# Altium project HMI_Driver.PrjPCB
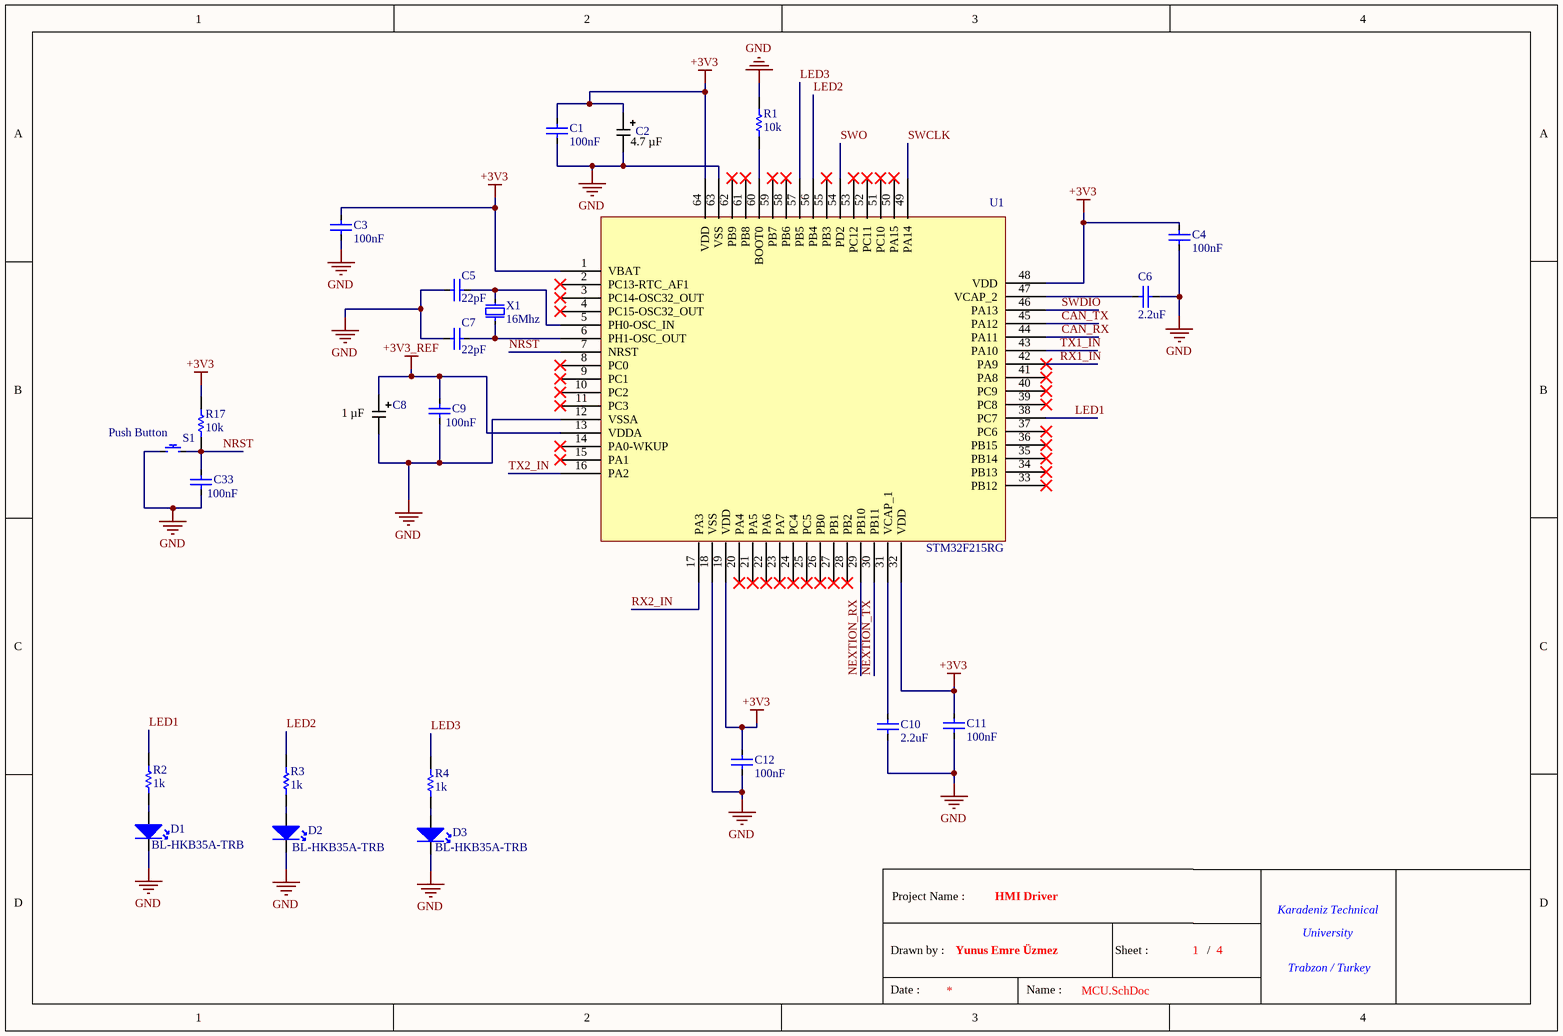
[diagram p0: MCU.SchDoc]
Person: Yunus Emre Üzmez; Project: HMI Driver
4 sheets, 82 parts. Net scope: global (net labels, ports and power ports of the same name join across sheets).
Board file: hmi_driver.PcbDoc
Sheets:
  MCU.SchDoc
  Peripheral.SchDoc
  Power.SchDoc
  Connectors.SchDoc

## Sheet MCU.SchDoc
size A4; DocumentNumber: 1; SheetNumber: 1; SheetTotal: 4

### Parts
(Parts that share a designator on the sheet are numbered #1, #2 ... from top to bottom, then left to right.)
*#1  Title Block  (value not drawn)  (graphical)
C1  100nF  [CAP-0603]
C2  Capacitance: 4.7 µF  [KEMET_CAP_TAN-B]  (hidden comment: T491B475K016AT)
C3  100nF  [CAP-0603]
C4  100nF  [CAP-0603]
C5  22pF  [CAP-0805]
C6  2.2uF  [CAP-0805]
C7  22pF  [CAP-0805]
C8  Capacitance: 1 µF  [KEMET_CAP_TAN-B]  (hidden comment: T491B105K025AT)
C9  100nF  [CAP-0603]
C10  2.2uF  [CAP-0805]
C11  100nF  [CAP-0603]
C12  100nF  [CAP-0603]
C33  100nF  [CAP-0603]
D1  BL-HKB35A-TRB  [LED-0805]
D2  BL-HKB35A-TRB  [LED-0805]
D3  BL-HKB35A-TRB  [LED-0805]
R1  10k  [RES-0603]
R2  1k  [RES-0603]
R3  1k  [RES-0603]
R4  1k  [RES-0603]
R17  10k  [RES-0603]
S1  Push Button  [2.54mm_Push Button]  (no BOM)
U1  STM32F215RG  [LQFP64]
X1  16Mhz  [OSC-THT (11.5*5.00*3.60)]

### Nets
+3V3: C1.2 C2.1 C3.2 C4.2 C11.2 C12.2 R17.1 U1.1(VBAT) U1.19(VDD) U1.32(VDD) U1.48(VDD) U1.64(VDD)
+3V3_REF: C8.1 C9.2 U1.13(VDDA)
GND: C1.1 C2.2 C3.1 C4.1 C5.2 C6.1 C7.1 C8.2 C9.1 C10.1 C11.1 C12.1 C33.1 D1.2(K) D2.2(K) D3.2(K) R1.2 S1.1 U1.12(VSSA) U1.18(VSS) U1.63(VSS)
CAN_RX: U1.44(PA11)
CAN_TX: U1.45(PA12)
LED1: R2.1 U1.38(PC7)
LED2: R3.1 U1.56(PB4)
LED3: R4.1 U1.57(PB5)
NEXTION_RX: U1.29(PB10)
NEXTION_TX: U1.30(PB11)
NRST: C33.2 R17.2 S1.2 U1.7(NRST)
RX1_IN: U1.42(PA9)
RX2_IN: U1.17(PA3)
SWCLK: U1.49(PA14)
SWDIO: U1.46(PA13)
SWO: U1.54(PD2)
TX1_IN: U1.43(PA10)
TX2_IN: U1.16(PA2)
NetC5_1: C5.1 U1.5(PH0-OSC_IN) X1.2
NetC6_2: C6.2 U1.47(VCAP_2)
NetC7_2: C7.2 U1.6(PH1-OSC_OUT) X1.1
NetC10_2: C10.2 U1.31(VCAP_1)
NetD1_1: D1.1(A) R2.2
NetD2_1: D2.1(A) R3.2
NetD3_1: D3.1(A) R4.2
NetR1_1: R1.1 U1.60(BOOT0)

Not connected (* = marked no-connect by the designer): U1 2(PC13-RTC_AF1)* 3(PC14-OSC32_OUT)* 4(PC15-OSC32_OUT)* 8(PC0)* 9(PC1)* 10(PC2)* 11(PC3)* 14(PA0-WKUP)* 15(PA1)* 20(PA4)* 21(PA5)* 22(PA6)* 23(PA7)* 24(PC4)* 25(PC5)* 26(PB0)* 27(PB1)* 28(PB2)* 33(PB12)* 34(PB13)* 35(PB14)* 36(PB15)* 37(PC6)* 39(PC8)* 40(PC9)* 41(PA8)* 50(PA15)* 51(PC10)* 52(PC11)* 53(PC12)* 55(PB3)* 58(PB6)* 59(PB7)* 61(PB8)* 62(PB9)*

### Notes on the sheet
- (in symbol Title Block) Project Name :; Karadeniz Technical; University; Drawn by :; Sheet :; /; Trabzon / Turkey; Date :; Name :

### Library data of the parts
*#1 = Title Block: Standart Title Block
C1 C3 C4 C9 C11 C12 C33 = CGA3E2X7R1H104K080AA: Manufacturer: TDK; Temperature Coefficient: X7R; Voltage: 50V; Library Reference: Capacitor; Tolerance: %10; Man Code: CGA3E2X7R1H104K080AA; Value: 100nF; Footprint: 0603; Component Type: Ceramic Capacitor
C2 = T491B475K016AT: CAP TANT 4.7UF 10% 16V 1411; Manufacturer: KEMET; Manufacturer Size Code: B; Type: Molded; ESR (Equivalent Series Resistance): 3.5 Ohm; Lifetime @ Temp.: 2000 Hrs @ 125°C; Series: T491; Package: Tape & Reel (TR); Tolerance: ±10%; Operating Temperature: -55°C ~ 125°C; Mounting Type: Surface Mount; Package / Case: 1411 (3528 Metric); Size / Dimension: 0.138" L x 0.110" W (3.50mm x 2.80mm); Height - Seated (Max): 0.083" (2.10mm); Lead Spacing: -; Ratings: -; Features: General Purpose; Failure Rate: -; Voltage - Rated: 16 V; Ozdisan Link: https://ozdisan.com/pasif-komponentler/kondansatorler/tantal-kondansatorler/T491B475K016AT; Digikey Link: https://www.digikey.com/en/products/detail/kemet/T491B475K016AT/818582; Farnell TR Link: https://tr.farnell.com/kemet/t491b475k016at/cap-4-7-f-16v-10-smd/dp/1457453?st=t491b475k016at; Mouser Link: https://www.mouser.com.tr/ProductDetail/KEMET/T491B475K016AT?qs=pWsseJt92L15yATvg%252BRzxw%3D%3D
C5 C7 = CL21C220JBANNNC: Manufacturer: Samsung Electro-Mechanics; Temperature Coefficient: C0G; Voltage: 50V; Library Reference: Capacitor; Tolerance: %5; Man Code: CL21C220JBANNNC; Value: 22pF; Footprint: 0805; Component Type: Ceramic Capacitor
C6 C10 = CL21B225KAFVPNE_1: Manufacturer: Samsung Electro-Mechanics; Library Reference: Capacitor; Temperature Coefficient: X7R; Tolerance: %10; Voltage: 25V; Component Type: Ceramic Capacitor; Footprint: 0805; Man Code: CL21B225KAFVPNE; Value: 2.2uF
C8 = T491B105K025AT: CAP TANT 1UF 10% 25V 1411; Manufacturer: KEMET; Manufacturer Size Code: B; Type: Molded; ESR (Equivalent Series Resistance): 5 Ohm; Lifetime @ Temp.: 2000 Hrs @ 125°C; Series: T491; Package: Tape & Reel (TR); Tolerance: ±10%; Operating Temperature: -55°C ~ 125°C; Mounting Type: Surface Mount; Package / Case: 1411 (3528 Metric); Size / Dimension: 0.138" L x 0.110" W (3.50mm x 2.80mm); Height - Seated (Max): 0.083" (2.10mm); Lead Spacing: -; Ratings: -; Features: General Purpose; Failure Rate: -; Voltage - Rated: 25 V; Ozdisan Link: https://ozdisan.com/pasif-komponentler/kondansatorler/tantal-kondansatorler/T491B105K025AT; Digikey Link: https://www.digikey.com/en/products/detail/kemet/T491B105K025AT/3724810; Farnell TR Link: https://tr.farnell.com/kemet/t491b105k025at/cap-1-f-25v-10/dp/2321211?st=t491b105k025at; Mouser Link: https://www.mouser.com.tr/ProductDetail/KEMET/T491B105K025AT?qs=MSnLt6VizIVP1rbCgJ%252B8hw%3D%3D
D1-D3 = BL-HKB35A-TRB: Manufacturer: BRIGHT LED; Colour: Yellow; Vf: 2.2V; Library Reference: Miscellaneous; Luminous Intensity: 94mcd; If: 20mA; Lens Transparency: Water Clear; Man Code: BL-HKB35A-TRB; Footprint: 0805; Component Type: Led
R1 R17 = CRCW060310K0FKEA: Manufacturer: Vishay; Tolerance: %1; Power: 0.1W; Library Reference: Resistor; Man Code: CRCW060310K0FKEA; Value: 10k; Footprint: 0603; Component Type: Chip Resistor
R2-R4 = CRCW06031K00FKEAC: Manufacturer: Vishay; Library Reference: Resistor; Tolerance: %1; Power: 0.1W; Man Code: CRCW06031K00FKEAC; Footprint: 0603; Component Type: Chip Resistor; Value: 1k
S1 = Push Button: Library Reference: Other Switches; Component Type: Push Button
U1 = STM32F215RG: Manufacturer: STM; Speed: 120 mHz; Program Memory Size: 1 MB; Supply Voltage: 1.8V-3.6V; Number of Bits: 32; Number of I/O: 51; Component Type: Microcontroller; Man Code: STM32F215RG
X1 = AS49S-16M-FC160F3: Manufacturer: ANSEN; Frequency Tolerance: 20ppm; Frequency Stability: 50ppm; Library Reference: Miscellaneous; Capacitance: 16pF; ESR: 30ohm; Man Code: AS49S-16M-FC160F3; Value: 16Mhz; Component Type: Crystal Oscillator; Footprint: THT (11.5*5.00*3.60)

## Sheet Peripheral.SchDoc
size A4; DocumentNumber: 2; SheetNumber: 2; SheetTotal: 4
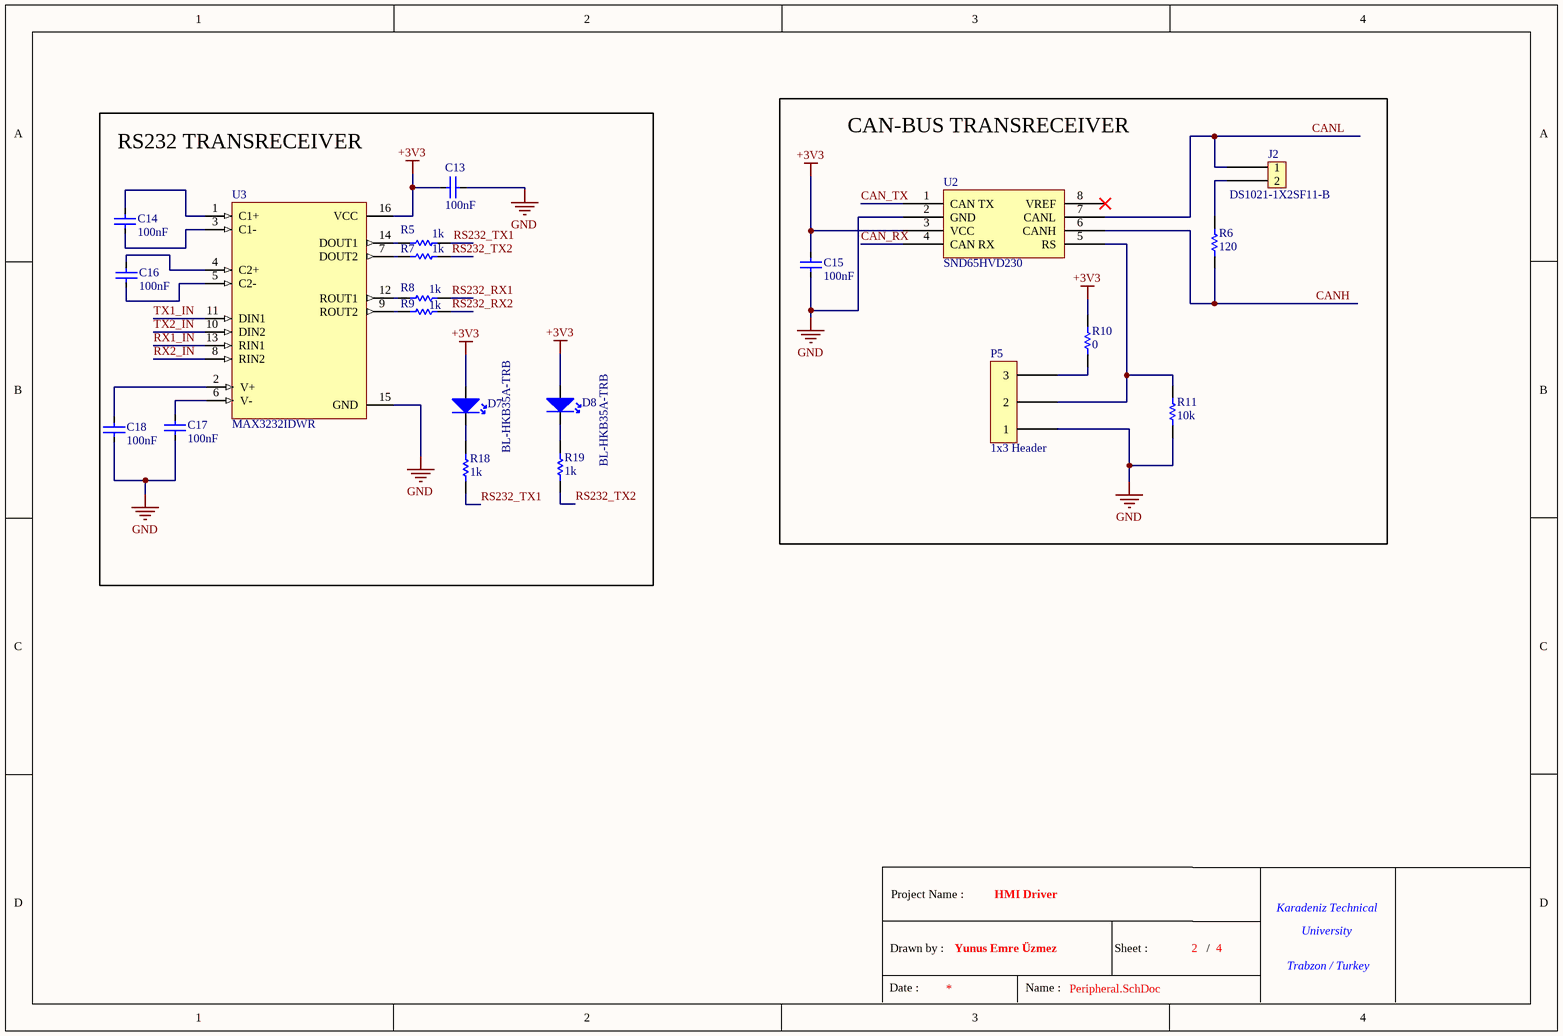
[diagram p1: Peripheral.SchDoc]

### Parts
(Parts that share a designator on the sheet are numbered #1, #2 ... from top to bottom, then left to right.)
*#2  Title Block  (value not drawn)  (graphical)
C13  100nF  [CAP-0603]
C14  100nF  [CAP-0603]
C15  100nF  [CAP-0603]
C16  100nF  [CAP-0603]
C17  100nF  [CAP-0603]
C18  100nF  [CAP-0603]
D7  BL-HKB35A-TRB  [LED-0805]
D8  BL-HKB35A-TRB  [LED-0805]
J2  DS1021-1X2SF11-B  [1x2 HEADER]
P5  1x3 Header  [1x3 Header (2.54 mm)]
R5  1k  [RES-0603]
R6  120  [RES-0603]
R7  1k  [RES-0603]
R8  1k  [RES-0603]
R9  1k  [RES-0603]
R10  0  [RES-0603]
R11  10k  [RES-0603]
R18  1k  [RES-0603]
R19  1k  [RES-0603]
U2  SND65HVD230  [SOIC-8]
U3  MAX3232IDWR  [SOIC-16]

### Blocks framed on the sheet
RS232 TRANSRECEIVER: C13 C14 C16-C18 D7 D8 R5 R7-R9 R18 R19 U3
CAN-BUS TRANSRECEIVER: C15 J2 P5 R6 R10 R11 U2

### Nets
+3V3: C13.2 C15.1 D7.1(A) D8.1(A) R10.2 U2.3(VCC) U3.16(VCC)
GND: C13.1 C15.2 C17.2 C18.2 P5.1 R11.1 U2.2(GND) U3.15(GND)
CAN_RX: U2.4(CAN_RX)
CAN_TX: U2.1(CAN_TX)
CANH: R6.2 U2.6(CANH)
CANL: J2.1 U2.7(CANL)
RS232_RX1: R8.1
RS232_RX2: R9.1
RS232_TX1: R5.1 R18.2
RS232_TX2: R7.1 R19.2
RX1_IN: U3.13(RIN1)
RX2_IN: U3.8(RIN2)
TX1_IN: U3.11(DIN1)
TX2_IN: U3.10(DIN2)
NetC14_1: C14.1 U3.1(C1+)
NetC14_2: C14.2 U3.3(C1-)
NetC16_1: C16.1 U3.4(C2+)
NetC16_2: C16.2 U3.5(C2-)
NetC17_1: C17.1 U3.6(V-)
NetC18_1: C18.1 U3.2(V+)
NetD7_2: D7.2(K) R18.1
NetD8_2: D8.2(K) R19.1
NetJ2_2: J2.2 R6.1
NetP5_2: P5.2 R11.2 U2.5(RS)
NetP5_3: P5.3 R10.1
NetR5_2: R5.2 U3.14(DOUT1)
NetR7_2: R7.2 U3.7(DOUT2)
NetR8_2: R8.2 U3.12(ROUT1)
NetR9_2: R9.2 U3.9(ROUT2)

Not connected (* = marked no-connect by the designer): U2 8(VREF)*

### Notes on the sheet
- (in symbol Title Block) Project Name :; Karadeniz Technical; University; Drawn by :; Sheet :; /; Trabzon / Turkey; Date :; Name :

### Library data of the parts
*#2 = Title Block: Standart Title Block
C13-C18 = CGA3E2X7R1H104K080AA: as C1 on sheet MCU; Man Code: CGA3E2X7R1H104K080AA; Value: 100nF; Footprint: 0603; Component Type: Ceramic Capacitor
D7 D8 = BL-HKB35A-TRB: as D1 on sheet MCU; Man Code: BL-HKB35A-TRB; Footprint: 0805; Component Type: Led
J2 = DS1021-1X2SF11-B: Manufacturer: KLS Electronic; Number of Row: 1; Pitch: 2.54mm; Component Type: Header; Man Code: DS1021-1X2SF11-B; Number of Pins: 2
P5 = 1x3 Header: Contact Number: 3; Gender: Male; Mounting Angle: 180; Number of Row: 1; Pitch: 2.54 mm; Component Type: Connector; Footprint: *; Library Reference: *; Man Code: 1x3 Header; Mounting Style: THT
R5 R7-R9 R18 R19 = CRCW06031K00FKEAC: as R2 on sheet MCU; Man Code: CRCW06031K00FKEAC; Footprint: 0603; Component Type: Chip Resistor; Value: 1k
R6 = RC0603FR-07120RL: Manufacturer: YAGEO; Compnenet Type: Chip Resistor; Tolerance: %1; Voltage: 75V; Man Code: RC0603FR-07120RL; Value: 120; Footprint: 0603
R10 = 0603SAJ0000T5E: Manufacturer: ROYALOHM; Tolerance: %5; Voltage: 75V; Component Type: Chip Resistor; Value: 0; Man Code: 0603SAJ0000T5E; Footprint: 0603
R11 = CRCW060310K0FKEA: as R1 on sheet MCU; Man Code: CRCW060310K0FKEA; Value: 10k; Footprint: 0603; Component Type: Chip Resistor
U2 = SND65HVD230: Manufacturer: TI; Man Code: SN65HVD230; Component Type: CAN-BUS Transreceiver
U3 = MAX3232IDWR: Manufacturer: Texas; Supply Voltage: 3V to 5V; Data Rate: 250kbps; Man Code: MAX3232IDWR; Component Type: IC Driver

## Sheet Power.SchDoc
size A4; DocumentNumber: 3; SheetNumber: 3; SheetTotal: 4
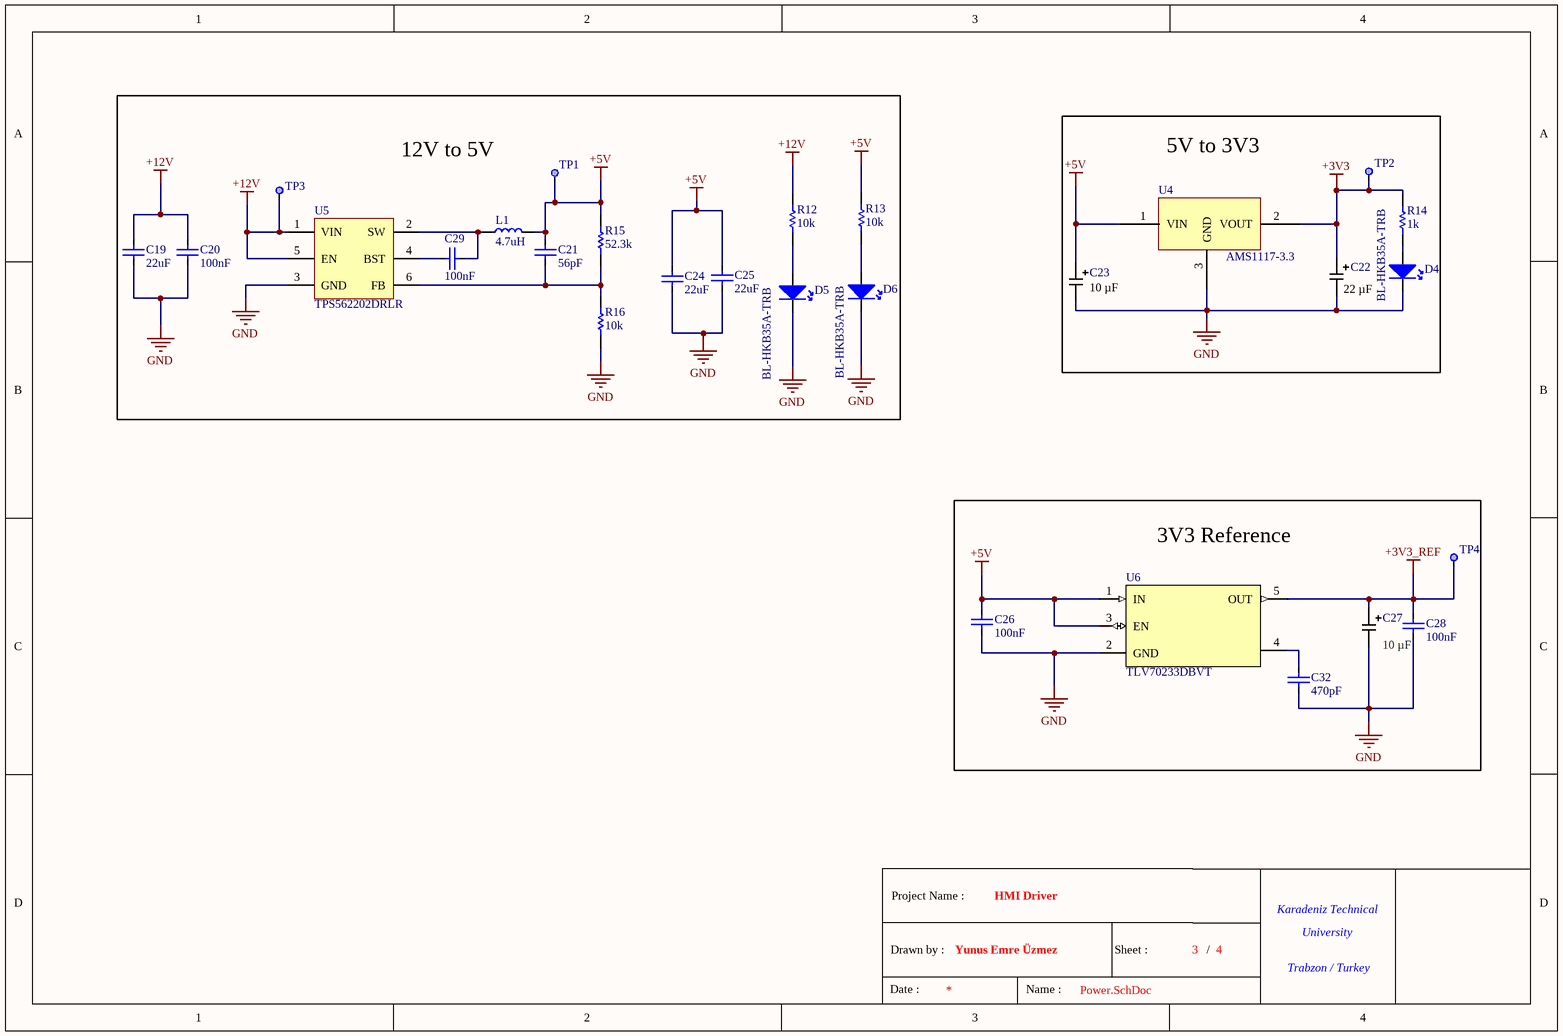
[diagram p2: Power.SchDoc]

### Parts
(Parts that share a designator on the sheet are numbered #1, #2 ... from top to bottom, then left to right.)
*#3  Title Block  (value not drawn)  (graphical)
C19  22uF  [CAP-1210]
C20  100nF  [CAP-0603]
C21  56pF  [CAP-0603]
C22  Capacitance: 22 µF  [KEMET_CAP_TAN-B]  (hidden comment: T491B226K020AT)
C23  Capacitance: 10 µF  [KEMET_CAP_TAN-B]  (hidden comment: T491B106M016AT)
C24  22uF  [CAP-1210]
C25  22uF  [CAP-1210]
C26  100nF  [CAP-0603]
C27  Capacitance: 10 µF  [KEMET_CAP_TAN-B]  (hidden comment: T491B106M016AT)
C28  100nF  [CAP-0603]
C29  100nF  [CAP-0603]
C32  470pF  [CAP-0603]
D4  BL-HKB35A-TRB  [LED-0805]
D5  BL-HKB35A-TRB  [LED-0805]
D6  BL-HKB35A-TRB  [LED-0805]
L1  4.7uH  [IND_EATON_DR125-4R7-R]
R12  10k  [RES-0603]
R13  10k  [RES-0603]
R14  1k  [RES-0603]
R15  52.3k  [RES-0603]
R16  10k  [RES-0603]
TP1  Test Point  [0.8mm Test Point]  (value not drawn)  (no BOM)
TP2  Test Point  [0.8mm Test Point]  (value not drawn)  (no BOM)
TP3  Test Point  [0.8mm Test Point]  (value not drawn)  (no BOM)
TP4  Test Point  [0.8mm Test Point]  (value not drawn)  (no BOM)
U4  AMS1117-3.3  [SOT-223]
U5  TPS562202DRLR  [SOT-563]
U6  TLV70233DBVT  [SOT23-5]

### Blocks framed on the sheet
12V to 5V: C19-C21 C24 C25 C29 D5 D6 L1 R12 R13 R15 R16 TP1 TP3 U5
5V to 3V3: C22 C23 D4 R14 TP2 U4
3V3 Reference: C26-C28 C32 TP4 U6

### Nets
+3V3: C22.1 R14.1 TP2.1 U4.2(VOUT)
+3V3_REF: C27.1 C28.2 TP4.1 U6.5(OUT)
+5V: C21.2 C23.1 C24.2 C25.2 C26.2 L1.2 R13.2 R15.2 TP1.1 U4.1(VIN) U6.1(IN) U6.3(EN)
+12V: C19.2 C20.2 R12.2 TP3.1 U5.1(VIN) U5.5(EN)
GND: C19.1 C20.1 C22.2 C23.2 C24.1 C25.1 C26.1 C27.2 C28.1 C32.1 D4.2(K) D5.2(K) D6.2(K) R16.1 U4.3(GND) U5.3(GND) U6.2(GND)
NetC21_1: C21.1 R15.1 R16.2 U5.6(FB)
NetC29_1: C29.1 L1.1 U5.2(SW)
NetC29_2: C29.2 U5.4(BST)
NetC32_2: C32.2 U6.4
NetD4_1: D4.1(A) R14.2
NetD5_1: D5.1(A) R12.1
NetD6_1: D6.1(A) R13.1

### Notes on the sheet
- (in symbol Title Block) Project Name :; Karadeniz Technical; University; Drawn by :; Sheet :; /; Trabzon / Turkey; Date :; Name :

### Library data of the parts
*#3 = Title Block: Standart Title Block
C19 C24 C25 = CL32B226KAJNNNE: Manufacturer: Samsung Electro-Mechanics; Temperature Coefficient: X7R; Voltage: 25V; Library Reference: Capacitor; Tolerance: %10; Man Code: CL32B226KAJNNNE; Value: 22uF; Footprint: 1210; Component Type: Ceramic Capacitor
C20 C26 C28 C29 = CGA3E2X7R1H104K080AA: as C1 on sheet MCU; Man Code: CGA3E2X7R1H104K080AA; Value: 100nF; Footprint: 0603; Component Type: Ceramic Capacitor
C21 = GCM1885C2A560FA16D: Manufacturer: Murata; Library Reference: Capacitor; Tolerance: %1; Temperature Coefficient: C0G; Voltage: 100V; Man Code: GCM1885C2A560FA16D; Value: 56pF; Footprint: 0603; Component Type: Ceramic Capacitor
C22 = T491B226K020AT: CAP TANT 22UF 10% 20V 1411; Manufacturer: KEMET; Manufacturer Size Code: B; Type: Molded; ESR (Equivalent Series Resistance): 4 Ohm; Lifetime @ Temp.: 2000 Hrs @ 125°C; Series: T491; Package: Tape & Reel (TR); Tolerance: ±10%; Operating Temperature: -55°C ~ 125°C; Mounting Type: Surface Mount; Package / Case: 1411 (3528 Metric); Size / Dimension: 0.138" L x 0.110" W (3.50mm x 2.80mm); Height - Seated (Max): 0.083" (2.10mm); Lead Spacing: -; Ratings: -; Features: General Purpose; Failure Rate: -; Voltage - Rated: 20 V; Ozdisan Link: https://ozdisan.com/pasif-komponentler/kondansatorler/tantal-kondansatorler/T491B226K020AT; Digikey Link: https://www.digikey.com/en/products/detail/kemet/T491B226K020AT/1842086; Farnell TR Link: https://tr.farnell.com/kemet/t491b226k020at/cap-22-f-20v-10/dp/2321214?st=t491b226k020at; Mouser Link: https://www.mouser.com.tr/ProductDetail/KEMET/T491B226K020AT?qs=2QcrrtqkWlnFmgDgM5wdlA%3D%3D
C23 C27 = T491B106M016AT: CAP TANT 10UF 20% 16V 1411; Manufacturer: KEMET; Manufacturer Size Code: B; Type: Molded; ESR (Equivalent Series Resistance): 2.5 Ohm; Lifetime @ Temp.: 2000 Hrs @ 125°C; Series: T491; Package: Tape & Reel (TR); Tolerance: ±20%; Operating Temperature: -55°C ~ 125°C; Mounting Type: Surface Mount; Package / Case: 1411 (3528 Metric); Size / Dimension: 0.138" L x 0.110" W (3.50mm x 2.80mm); Height - Seated (Max): 0.083" (2.10mm); Lead Spacing: -; Ratings: -; Features: General Purpose; Failure Rate: -; Voltage - Rated: 16 V; Ozdisan Link: https://ozdisan.com/pasif-komponentler/kondansatorler/tantal-kondansatorler/T491B106M016AT; Digikey Link: https://www.digikey.com/en/products/detail/kemet/T495B475M025ZTE750/8764094; Farnell TR Link: https://tr.farnell.com/kemet/t491b106m016at/cap-10-f-16v-20/dp/2462772?st=t491b106m016at; Mouser Link: https://www.mouser.com.tr/ProductDetail/KEMET/T491B106M016AT?qs=WydH9nGI6cAnkEyQJLjSzA%3D%3D
C32 = CL10B471KB8NNNC: Manufacturer: Samsung; Voltage: 50V; Tolerance: %10; Component Type: Capacitor; Footprint: 0603; Man Code: CL10B471KB8NNNC; Value: 470pF
D4-D6 = BL-HKB35A-TRB: as D1 on sheet MCU; Man Code: BL-HKB35A-TRB; Footprint: 0805; Component Type: Led
L1 = DR125-4R7-R: Manufacturer: Eaton; Max Dc Resistance: 10.5mOhm; Tolerance: %20; Max DC Current: 7.18A; Library Reference: Inductor; Man Code: DR125-4R7-R; Value: 4.7uH; Footprint: Surface Mount (12.5mm* 12.5mm); Component Type: Fixed Inductor
R12 R13 R16 = CRCW060310K0FKEA: as R1 on sheet MCU; Man Code: CRCW060310K0FKEA; Value: 10k; Footprint: 0603; Component Type: Chip Resistor
R14 = CRCW06031K00FKEAC: as R2 on sheet MCU; Man Code: CRCW06031K00FKEAC; Footprint: 0603; Component Type: Chip Resistor; Value: 1k
R15 = ERJ-3EKF5232V: Manufacturer: Panasonic; Tolerance: %1; Power: 0.1W; Library Reference: Resistor; Man Code: ERJ-3EKF5232V; Value: 52.3k; Footprint: 0603; Component Type: Chip Resistor
TP1-TP4 = Test Point: Library Reference: Miscellaneous; Component Type: Test Point
U4 = AMS1117-3.3: Manufacturer: Monolithic; Componenet Type: Regulator; Output Voltage: 3.3V; Output Current: 1A; Man Code: AMS1117-3.3
U5 = TPS562202DRLR: Manufacturer: Texas Instruments; Library Reference: Integrated_Circuit; Man Code: TPS562202DRLR; Component Type: Switcher
U6 = TLV70233DBVT: Manufacturer: TEXAS; Current: 300mA; Voltage: 3.3V; Component Type: LDO; Man Code: TLV70233DBVT

## Sheet Connectors.SchDoc
size A4; DocumentNumber: 4; SheetNumber: 4; SheetTotal: 4
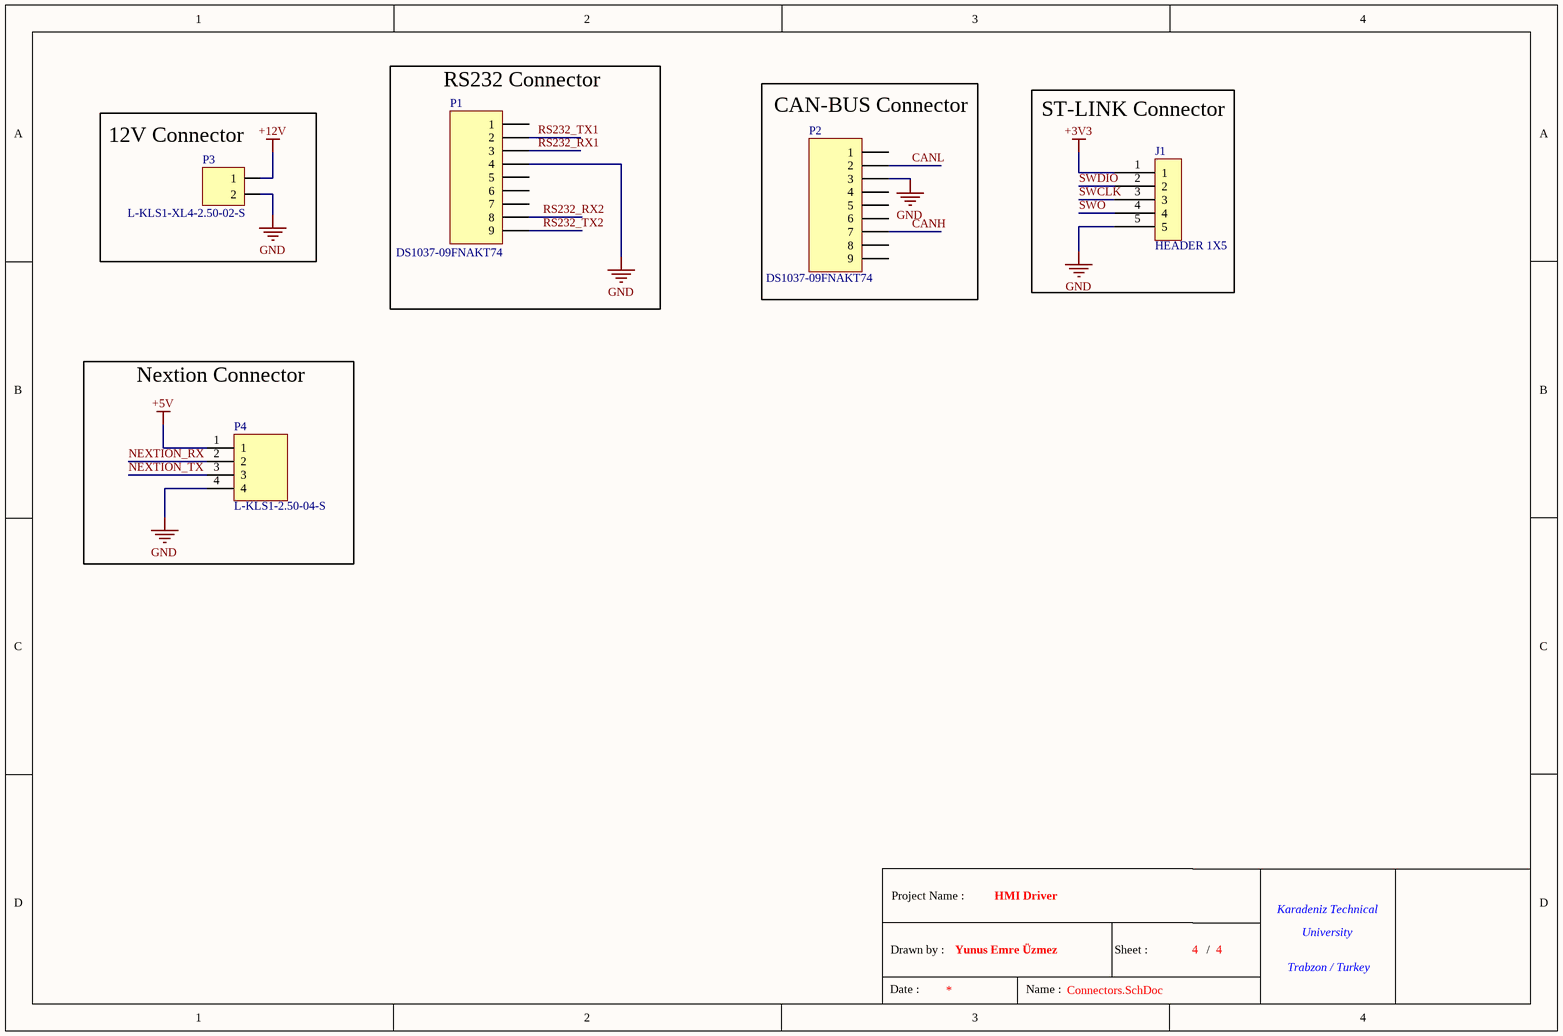
[diagram p3: Connectors.SchDoc]

### Parts
(Parts that share a designator on the sheet are numbered #1, #2 ... from top to bottom, then left to right.)
*#4  Title Block  (value not drawn)  (graphical)
J1  HEADER 1X5  [Header 2.54 1x5]
P1  DS1037-09FNAKT74  [D SUB 9PIN FEMALE 90C TH]
P2  DS1037-09FNAKT74  [D SUB 9PIN FEMALE 90C TH]
P3  L-KLS1-XL4-2.50-02-S  [2 PIN MALE 180C TH 2.50MM]
P4  L-KLS1-2.50-04-S  [1x4 TUNIC CONNECTOR]

### Blocks framed on the sheet
RS232 Connector: P1
CAN-BUS Connector: P2
12V Connector: P3
ST-LINK Connector: J1
Nextion Connector: P4

### Nets
+3V3: J1.1
+5V: P4.1
+12V: P3.1
GND: J1.5 P1.4 P2.3 P3.2 P4.4
CANH: P2.7
CANL: P2.2
NEXTION_RX: P4.2
NEXTION_TX: P4.3
RS232_RX1: P1.3
RS232_RX2: P1.8
RS232_TX1: P1.2
RS232_TX2: P1.9
SWCLK: J1.3
SWDIO: J1.2
SWO: J1.4

Not connected (* = marked no-connect by the designer): P1 1 5 6 7; P2 1 4 5 6 8 9

### Notes on the sheet
- (in symbol Title Block) Project Name :; Karadeniz Technical; University; Drawn by :; Sheet :; /; Trabzon / Turkey; Date :; Name :

### Library data of the parts
*#4 = Title Block: Standart Title Block
J1 = HEADER 1X5: 2.54mm 1x5 Header
P1 P2 = DS1037-09FNAKT74: Manufacturer: CONNFLY; Library Reference: Connector; Mating Connector: L-KLS1-213-09-M-L; Gender: Female; Contact Number: 9; Number of Row: 2; Mounting Angle: 90; Current(max): 1.5A; Contact Resistance(max): 20mohm; Pitch: 2.77mm; Man Code: DS1037-09FNAKT74; Component Type: D SUB 9 PIN Female Connector; Mounting Style: Through Hole
P3 = L-KLS1-XL4-2.50-02-S: Manufacturer: KLS ELECTRONIC; Contact Number: 3; Contact Resistance (Max): 10mohm; Current(Max): 3A; Gender: Male; Mounting Angle: 180; Number of Row: 1; Pitch: 2.50mm; Component Type: CONN 2PIN MALE 180C TH 2.5mm; Mounting Style: THT; Man Code: L-KLS1-XL4-2.50-02-S
P4 = L-KLS1-2.50-04-S: Manufacturer: KLS ELECTRONIC; Comopnent Type: Connector; Gender: Male; Pitch: 2.50mm; Man Code: L-KLS1-2.50-04-S; Mounting Type: THT; Number of pins: 4; Number of rows: 1

## Nets that join several sheets
+3V3: MCU (12 pins), Peripheral (7 pins), Power (C22.1 R14.1 TP2.1 U4.2), Connectors (J1.1)
+3V3_REF: MCU (C8.1 C9.2 U1.13), Power (C27.1 C28.2 TP4.1 U6.5)
+5V: Power (12 pins), Connectors (P4.1)
+12V: Power (6 pins), Connectors (P3.1)
GND: MCU (21 pins), Peripheral (8 pins), Power (17 pins), Connectors (5 pins)
CAN_RX: MCU (U1.44), Peripheral (U2.4)
CAN_TX: MCU (U1.45), Peripheral (U2.1)
CANH: Peripheral (R6.2 U2.6), Connectors (P2.7)
CANL: Peripheral (J2.1 U2.7), Connectors (P2.2)
NEXTION_RX: MCU (U1.29), Connectors (P4.2)
NEXTION_TX: MCU (U1.30), Connectors (P4.3)
RS232_RX1: Peripheral (R8.1), Connectors (P1.3)
RS232_RX2: Peripheral (R9.1), Connectors (P1.8)
RS232_TX1: Peripheral (R5.1 R18.2), Connectors (P1.2)
RS232_TX2: Peripheral (R7.1 R19.2), Connectors (P1.9)
RX1_IN: MCU (U1.42), Peripheral (U3.13)
RX2_IN: MCU (U1.17), Peripheral (U3.8)
SWCLK: MCU (U1.49), Connectors (J1.3)
SWDIO: MCU (U1.46), Connectors (J1.2)
SWO: MCU (U1.54), Connectors (J1.4)
TX1_IN: MCU (U1.43), Peripheral (U3.11)
TX2_IN: MCU (U1.16), Peripheral (U3.10)